# Altium project hexboard.PrjPcb
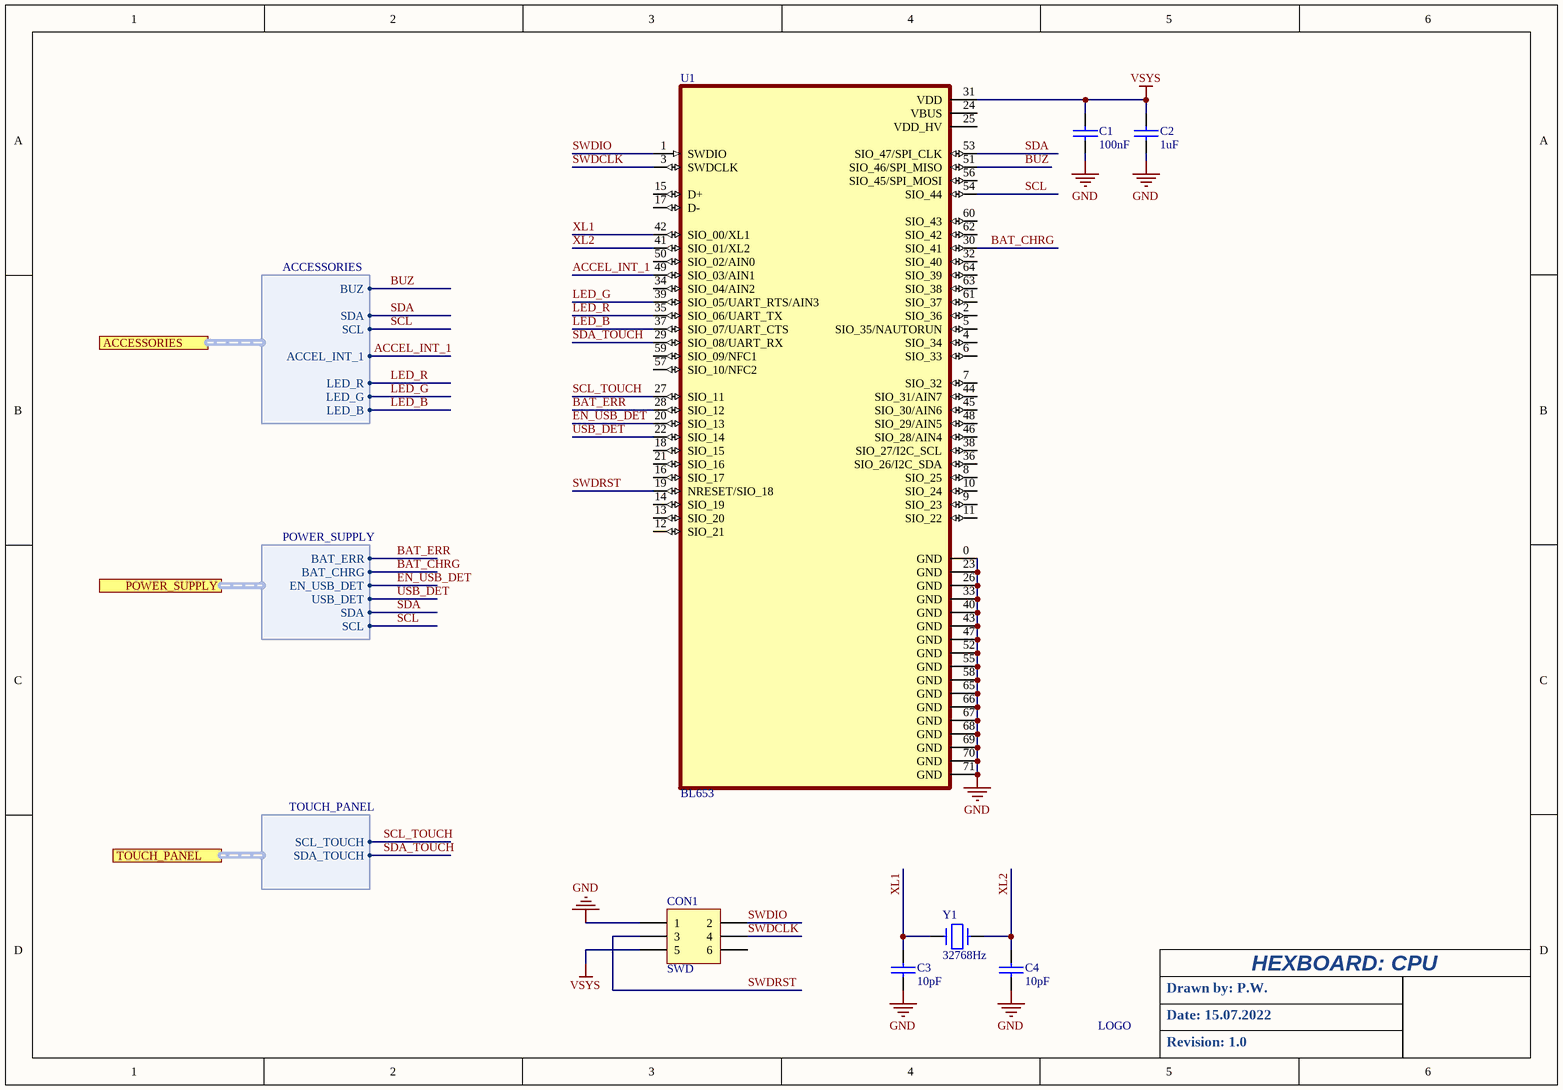
[diagram p0: CPU.SchDoc]
4 sheets, 67 parts. Net scope: flat (ports and power ports of the same name join across sheets).
Board files: hexboard_round.PcbDoc, hexboard_bottom.PcbDoc, hexboard_housing.PcbDoc, hexboard_top.PcbDoc
Sheets:
  CPU.SchDoc
  Power_supply.SchDoc
  Accessories.SchDoc
  Touch_panel.SchDoc

## Sheet CPU.SchDoc
size 292 x 203 mm

### Parts
*1  LOGO  [NEWLOGO2]  (value not drawn)
C1  100nF  [C0603L]
C2  1uF  [C0603L]
C3  10pF  [C0603L]
C4  10pF  [C0603L]
CON1  SWD  [HDR2x3_1mm27]
U1  BL653  [BL653]
Y1  32768Hz  [X_FC-13F]

### Ports
ACCESSORIES (harness ACCESSORIES), POWER_SUPPLY (harness POWER_SUPPLY), TOUCH_PANEL (harness TOUCH_PANEL)

### Harnesses
ACCESSORIES: ACCEL_INT_1, LED_R, LED_G, SDA, SCL, LED_B, BUZ
POWER_SUPPLY: BAT_ERR, BAT_CHRG, EN_USB_DET, SDA, SCL, USB_DET
TOUCH_PANEL: SDA_TOUCH, SCL_TOUCH

### Nets
GND: C1.2 C2.2 C3.2 C4.2 CON1.1 U1.0(GND) U1.23(GND) U1.26(GND) U1.33(GND) U1.40(GND) U1.43(GND) U1.47(GND) U1.52(GND) U1.55(GND) U1.58(GND) U1.65(GND) U1.66(GND) U1.67(GND) U1.68(GND) U1.69(GND) U1.70(GND) U1.71(GND)
VSYS: C1.1 C2.1 CON1.5 U1.31(VDD)
ACCEL_INT_1: U1.49(SIO_03/AIN1) ; port ACCESSORIES.ACCEL_INT_1
BAT_CHRG: U1.30(SIO_41) ; port POWER_SUPPLY.BAT_CHRG
BAT_ERR: U1.28(SIO_12) ; port POWER_SUPPLY.BAT_ERR
BUZ: U1.51(SIO_46/SPI_MISO) ; port ACCESSORIES.BUZ
EN_USB_DET: U1.20(SIO_13) ; port POWER_SUPPLY.EN_USB_DET
LED_B: U1.37(SIO_07/UART_CTS) ; port ACCESSORIES.LED_B
LED_G: U1.39(SIO_05/UART_RTS/AIN3) ; port ACCESSORIES.LED_G
LED_R: U1.35(SIO_06/UART_TX) ; port ACCESSORIES.LED_R
SCL: U1.54(SIO_44) ; port ACCESSORIES.SCL, port POWER_SUPPLY.SCL
SCL_TOUCH: U1.27(SIO_11) ; port TOUCH_PANEL.SCL_TOUCH
SDA: U1.53(SIO_47/SPI_CLK) ; port ACCESSORIES.SDA, port POWER_SUPPLY.SDA
SDA_TOUCH: U1.29(SIO_08/UART_RX) ; port TOUCH_PANEL.SDA_TOUCH
SWDCLK: CON1.4 U1.3(SWDCLK)
SWDIO: CON1.2 U1.1(SWDIO)
SWDRST: CON1.3 U1.19(NRESET/SIO_18)
USB_DET: U1.22(SIO_14) ; port POWER_SUPPLY.USB_DET
XL1: C3.1 U1.42(SIO_00/XL1) Y1.1
XL2: C4.1 U1.41(SIO_01/XL2) Y1.2

Not connected (* = marked no-connect by the designer): CON1 6; U1 2(SIO_36) 4(SIO_34) 5(SIO_35/NAUTORUN) 6(SIO_33) 7(SIO_32) 8(SIO_25) 9(SIO_23) 10(SIO_24) 11(SIO_22) 12(SIO_21) 13(SIO_20) 14(SIO_19) 15(D+) 16(SIO_17) 17(D-) 18(SIO_15) 21(SIO_16) 24(VBUS) 25(VDD_HV) 32(SIO_40) 34(SIO_04/AIN2) 36(SIO_26/I2C_SDA) 38(SIO_27/I2C_SCL) 44(SIO_31/AIN7) 45(SIO_30/AIN6) 46(SIO_28/AIN4) 48(SIO_29/AIN5) 50(SIO_02/AIN0) 56(SIO_45/SPI_MOSI) 57(SIO_10/NFC2) 59(SIO_09/NFC1) 60(SIO_43) 61(SIO_37) 62(SIO_42) 63(SIO_38) 64(SIO_39)

### Notes on the sheet
- HEXBOARD: CPU
- Drawn by: P.W.
- Date: 15.07.2022
- Revision: 1.0

### Library data of the parts
C1-C4 = CAP: Capacitor
CON1 = Header 3X2: Header, 3-Pin, Dual row; LatestRevisionDate: 17-Jul-2002; LatestRevisionNote: Re-released for DXP Platform.; Publisher: Altium Limited
U1 = BL653: 802.15.4, Bluetooth Bluetooth v5.0, Thread Transceiver Module 2.4GHz Integrated, Trace Surface Mount; MP: 451-00001; MF: Laird -; Digi-Key_Part_Number: 451-00001CT-ND; Value: *; SnapEDA_Link: https://www.snapeda.com/parts/451-00001/Laird%20-%20Wireless%20%26%20Thermal%20Systems/view-part/2777643/?ref=snap; Package: Module Laird -; Digi-Key_Purchase_URL: https://www.digikey.com/product-detail/en/laird-wireless-thermal-systems/451-00001/451-00001CT-ND/9489361?utm_source=snapeda&utm_medium=aggregator&utm_campaign=symbol
Y1 = CRYSTAL

## Sheet Power_supply.SchDoc
size 368 x 223 mm
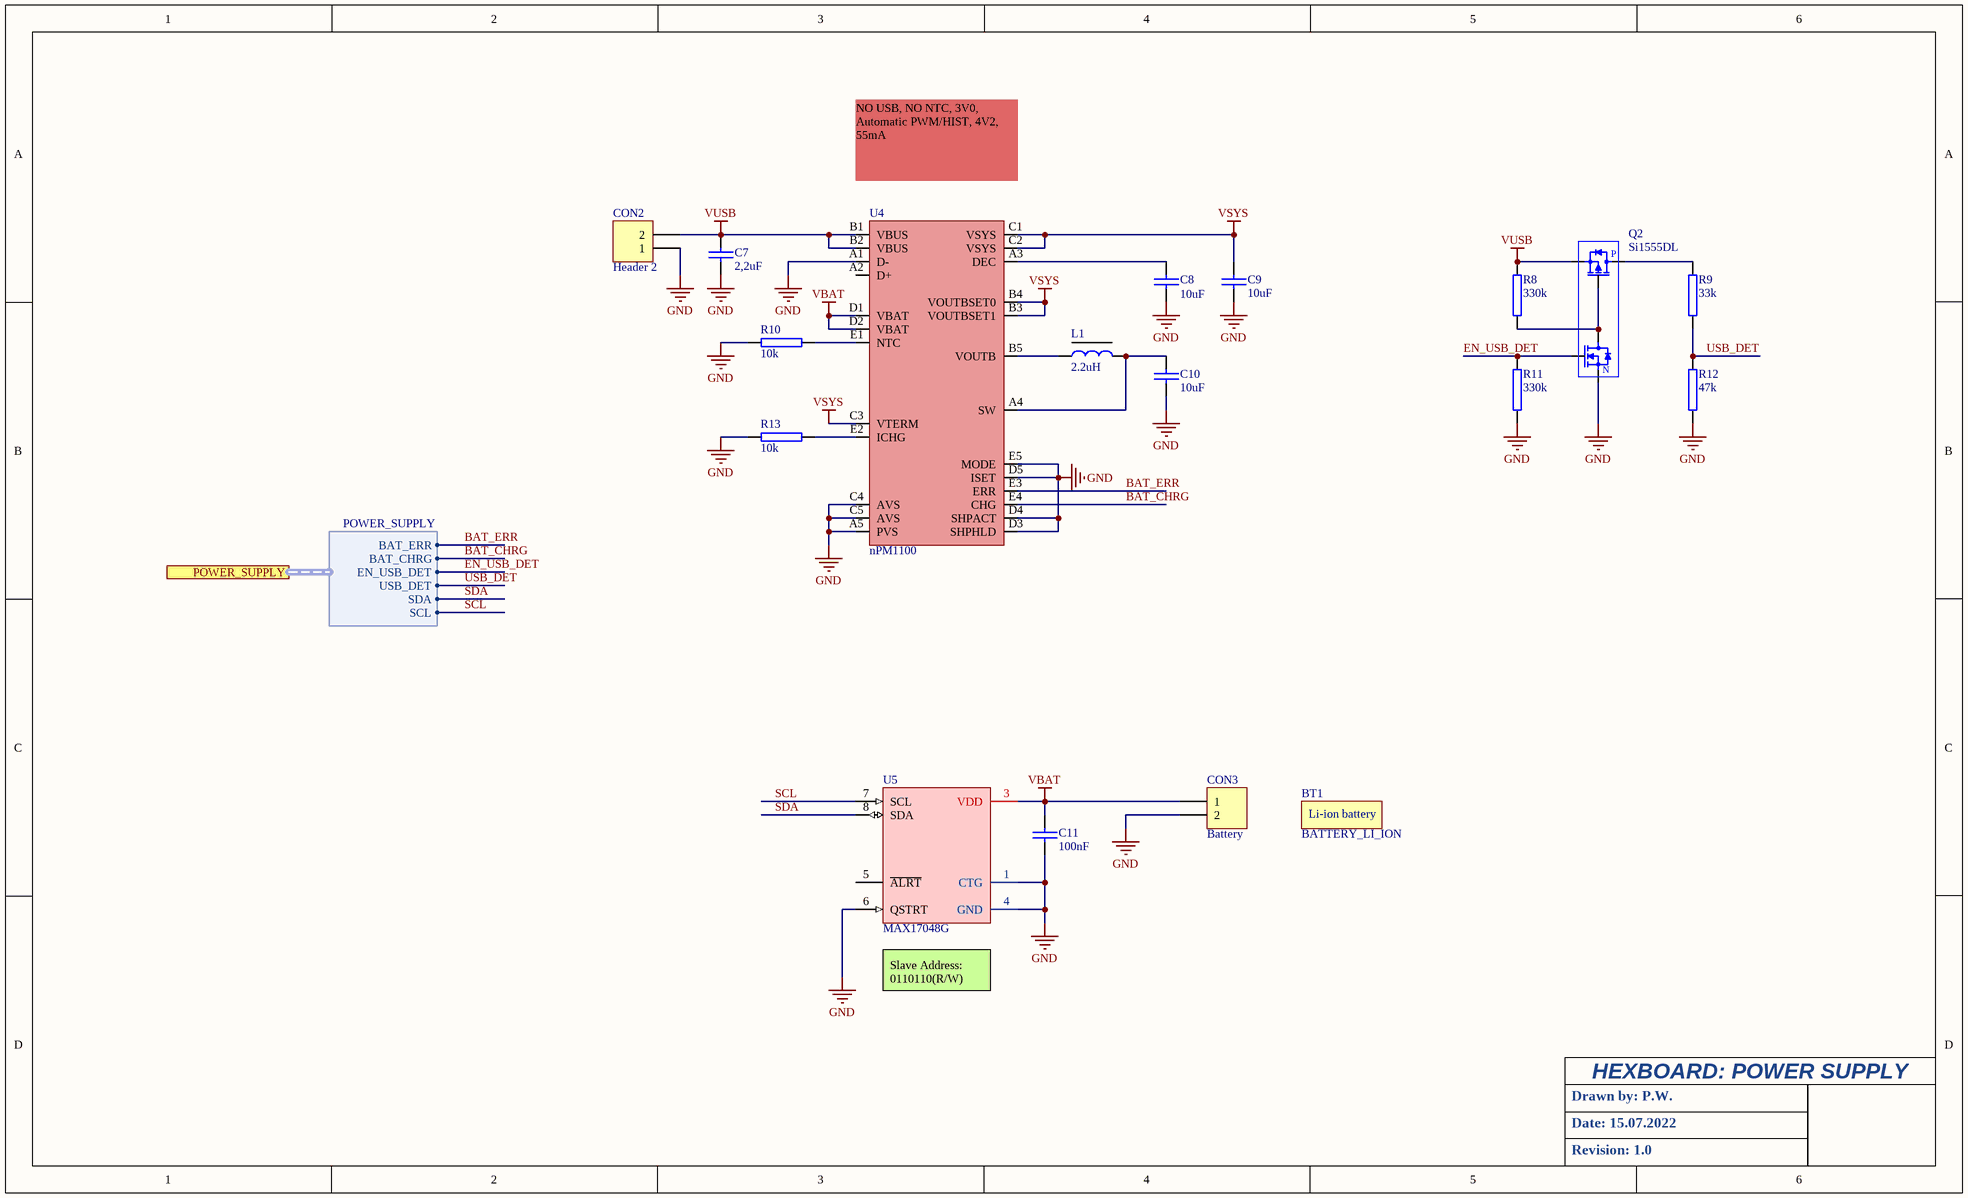
[diagram p1: Power_supply.SchDoc]

### Parts
BT1  BATTERY_LI_ION  [LI-ion battery 100mAh]
C7  2,2uF  [C0603L]
C8  10uF  [C0603L]
C9  10uF  [C0603L]
C10  10uF  [C0603L]
C11  100nF  [C0603L]
CON2  Header 2  [HDR1X2]
CON3  Battery  [HDR1X2_1mm27]
L1  2.2uH  [L0805]
Q2  Si1555DL  [SOT-363]
R8  330k  [1608[0603]]
R9  33k  [1608[0603]]
R10  10k  [1608[0603]]
R11  330k  [1608[0603]]
R12  47k  [1608[0603]]
R13  10k  [1608[0603]]
U4  nPM1100  [BGA25C40P5X5_207X207X52N]
U5  MAX17048G  [TDFN8_2x2x075]

### Ports
POWER_SUPPLY (harness POWER_SUPPLY)

### Harnesses
POWER_SUPPLY: BAT_ERR, BAT_CHRG, EN_USB_DET, SDA, SCL, USB_DET

### Nets
GND: C7.2 C8.2 C9.2 C10.2 C11.2 CON2.1 CON3.2 Q2.1(S1) R10.2 R11.1 R12.1 R13.2 U4.A1(D-) U4.A5(PVS) U4.C4(AVS) U4.C5(AVS) U4.D3(SHPHLD) U4.D4(SHPACT) U4.D5(ISET) U4.E5(MODE) U5.1(CTG) U5.4(GND) U5.6(QSTRT)
VBAT: C11.1 CON3.1 U4.D1(VBAT) U4.D2(VBAT) U5.3(VDD)
VSYS: C9.1 U4.B3(VOUTBSET1) U4.B4(VOUTBSET0) U4.C1(VSYS) U4.C2(VSYS) U4.C3(VTERM)
VUSB: C7.1 CON2.2 Q2.4(S2) R8.2 U4.B1(VBUS) U4.B2(VBUS)
BAT_CHRG: U4.E4(CHG) ; port POWER_SUPPLY.BAT_CHRG
BAT_ERR: U4.E3(ERR) ; port POWER_SUPPLY.BAT_ERR
EN_USB_DET: Q2.2(G1) R11.2 ; port POWER_SUPPLY.EN_USB_DET
SCL: U5.7(SCL) ; port POWER_SUPPLY.SCL
SDA: U5.8(SDA) ; port POWER_SUPPLY.SDA
USB_DET: R9.1 R12.2 ; port POWER_SUPPLY.USB_DET
NetC8_1: C8.1 U4.A3(DEC)
NetC10_1: C10.1 L1.2 U4.A4(SW)
NetL1_1: L1.1 U4.B5(VOUTB)
NetQ2_3: Q2.3(D2) R9.2
NetQ2_5: Q2.5(G2) Q2.6(D1) R8.1
NetR10_1: R10.1 U4.E1(NTC)
NetR13_1: R13.1 U4.E2(ICHG)

Not connected (* = marked no-connect by the designer): U4 A2(D+); U5 5(~{ALRT})

### Notes on the sheet
- NO USB, NO NTC, 3V0, Automatic PWM/HIST, 4V2, 55mA
- (near U5) Slave Address:
  0110110(R/W)
- HEXBOARD: POWER SUPPLY
- Drawn by: P.W.
- Date: 15.07.2022
- Revision: 1.0
- (in symbol BATTERY_LI_ION) Li-ion battery
- (in symbol Si1555DL) P; N

### Library data of the parts
BT1 = BATTERY_LI_ION: Battery
C7-C11 = CAP: Capacitor
CON2 CON3 = Header 2: Header, 2-Pin; LatestRevisionDate: 17-Jul-2002; LatestRevisionNote: Re-released for DXP Platform.; Publisher: Altium Limited
L1 = INDUCTOR
Q2 = Si1555DL: Montage: SMD; ComponentLink1Description: Datasheet; ComponentLink1URL: https://www.diodes.com/assets/Datasheets/ds30380.pdf
R8-R13 = RES
U4 = nPM1100: Integrated Power Managment IC
U5 = MAX17048G: 1-Cell/2-Cell Fuel Gauge with ModelGauge

## Sheet Accessories.SchDoc
size A4
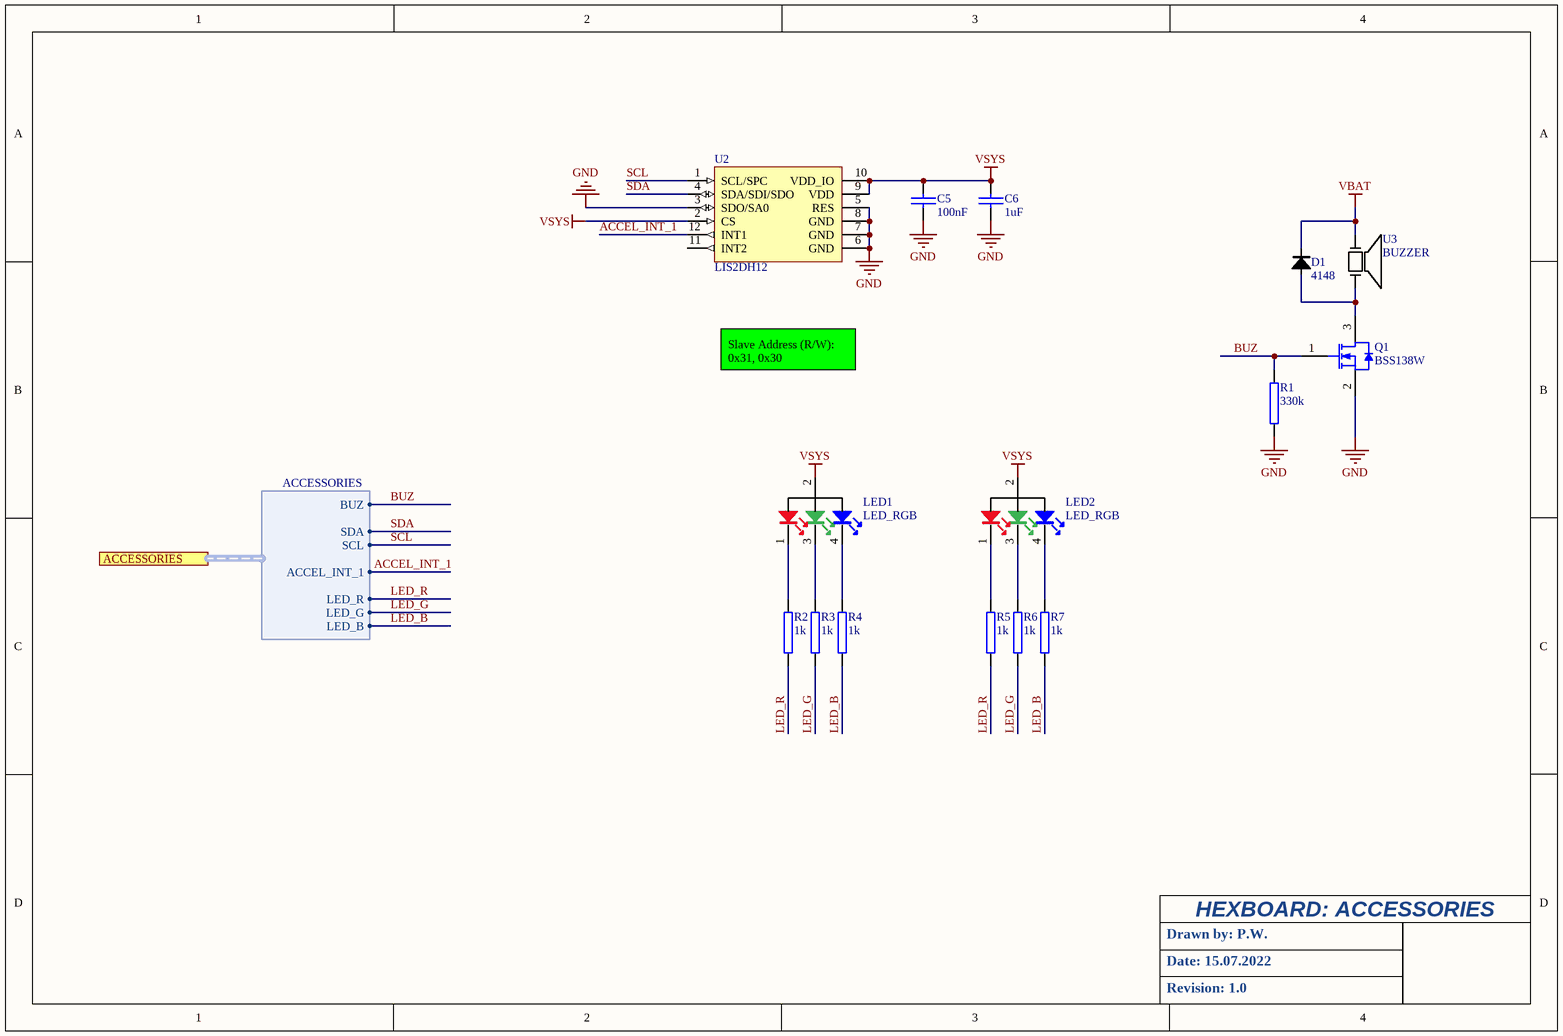
[diagram p2: Accessories.SchDoc]

### Parts
C5  100nF  [C0603L]
C6  1uF  [C0603L]
D1  4148  [0603-DIODE]
LED1  LED_RGB  [LED_604APFA3010LSEEZGKQ]
LED2  LED_RGB  [LED_604APFA3010LSEEZGKQ]
Q1  BSS138W  [SOT-323]
R1  330k  [1608[0603]]
R2  1k  [1608[0603]]
R3  1k  [1608[0603]]
R4  1k  [1608[0603]]
R5  1k  [1608[0603]]
R6  1k  [1608[0603]]
R7  1k  [1608[0603]]
U2  LIS2DH12  [LGA50P200X200X100-12N]
U3  BUZZER  [SMT28]

### Ports
ACCESSORIES (harness ACCESSORIES)

### Harnesses
ACCESSORIES: ACCEL_INT_1, LED_R, LED_G, SDA, SCL, LED_B, BUZ

### Nets
GND: C5.2 C6.2 Q1.2(S) R1.1 U2.3(SDO/SA0) U2.5(RES) U2.6(GND) U2.7(GND) U2.8(GND)
VBAT: D1.2(K) U3.2
VSYS: C5.1 C6.1 LED1.2(KG) LED2.2(KG) U2.2(CS) U2.9(VDD) U2.10(VDD_IO)
ACCEL_INT_1: U2.12(INT1) ; port ACCESSORIES.ACCEL_INT_1
BUZ: Q1.1(G) R1.2 ; port ACCESSORIES.BUZ
LED_B: R4.1 R7.1 ; port ACCESSORIES.LED_B
LED_G: R3.1 R6.1 ; port ACCESSORIES.LED_G
LED_R: R2.1 R5.1 ; port ACCESSORIES.LED_R
SCL: U2.1(SCL/SPC) ; port ACCESSORIES.SCL
SDA: U2.4(SDA/SDI/SDO) ; port ACCESSORIES.SDA
NetD1_1: D1.1(A) Q1.3(D) U3.1
NetLED1_1: LED1.1(KR) R2.2
NetLED1_3: LED1.3(KB) R3.2
NetLED1_4: LED1.4(AB) R4.2
NetLED2_1: LED2.1(KR) R5.2
NetLED2_3: LED2.3(KB) R6.2
NetLED2_4: LED2.4(AB) R7.2

Not connected (* = marked no-connect by the designer): U2 11(INT2)

### Notes on the sheet
- Slave Address (R/W): 0x31, 0x30
- HEXBOARD: ACCESSORIES
- Drawn by: P.W.
- Date: 15.07.2022
- Revision: 1.0

### Library data of the parts
C5 C6 = CAP: Capacitor
D1 = D: DIODE
LED1 LED2 = LED_RGB_2: Red/green/blue LED
Q1 = BSS138W: N-MOSFET; Manufacturer 1: -; Manufacturer 1 PartNo: -; Supplier 1: -; Supplier 1 PartNo: -
R1-R7 = RES
U2 = LIS2xx12: 3-axis - ±2g/±4g/±8g/±16g digital output femto accelerometer; Manufacturer: STMicroelectronics; 2nd source part number: 243-3081; Part number IPS: 00000007817; Note: MEMS digital output motion sensor ultra low-power high performance 3-axes "femto" accelerometer; Artikkelnr Noca: N.A.; Part Number: LIS2DH12; Manufacturer Part Number: LIS2DH12; Datasheet: http://www.st.com/st-web-ui/static/active/en/resource/technical/document/datasheet/DM00091513.pdf; Footprint Doc: LGA-12; LatestRevisionDate: 2015-09-29; Pin Count: 12; Publisher: Nordic Semiconductor; Published: 2015-09-29; Value: LIS2DH12; Supplier: Digi-Key; Supplier part number: 497-14851-1-ND; 2nd source Supplier: Farnell; Artikkelnr Simpro: N.A.

## Sheet Touch_panel.SchDoc
size 381 x 279 mm
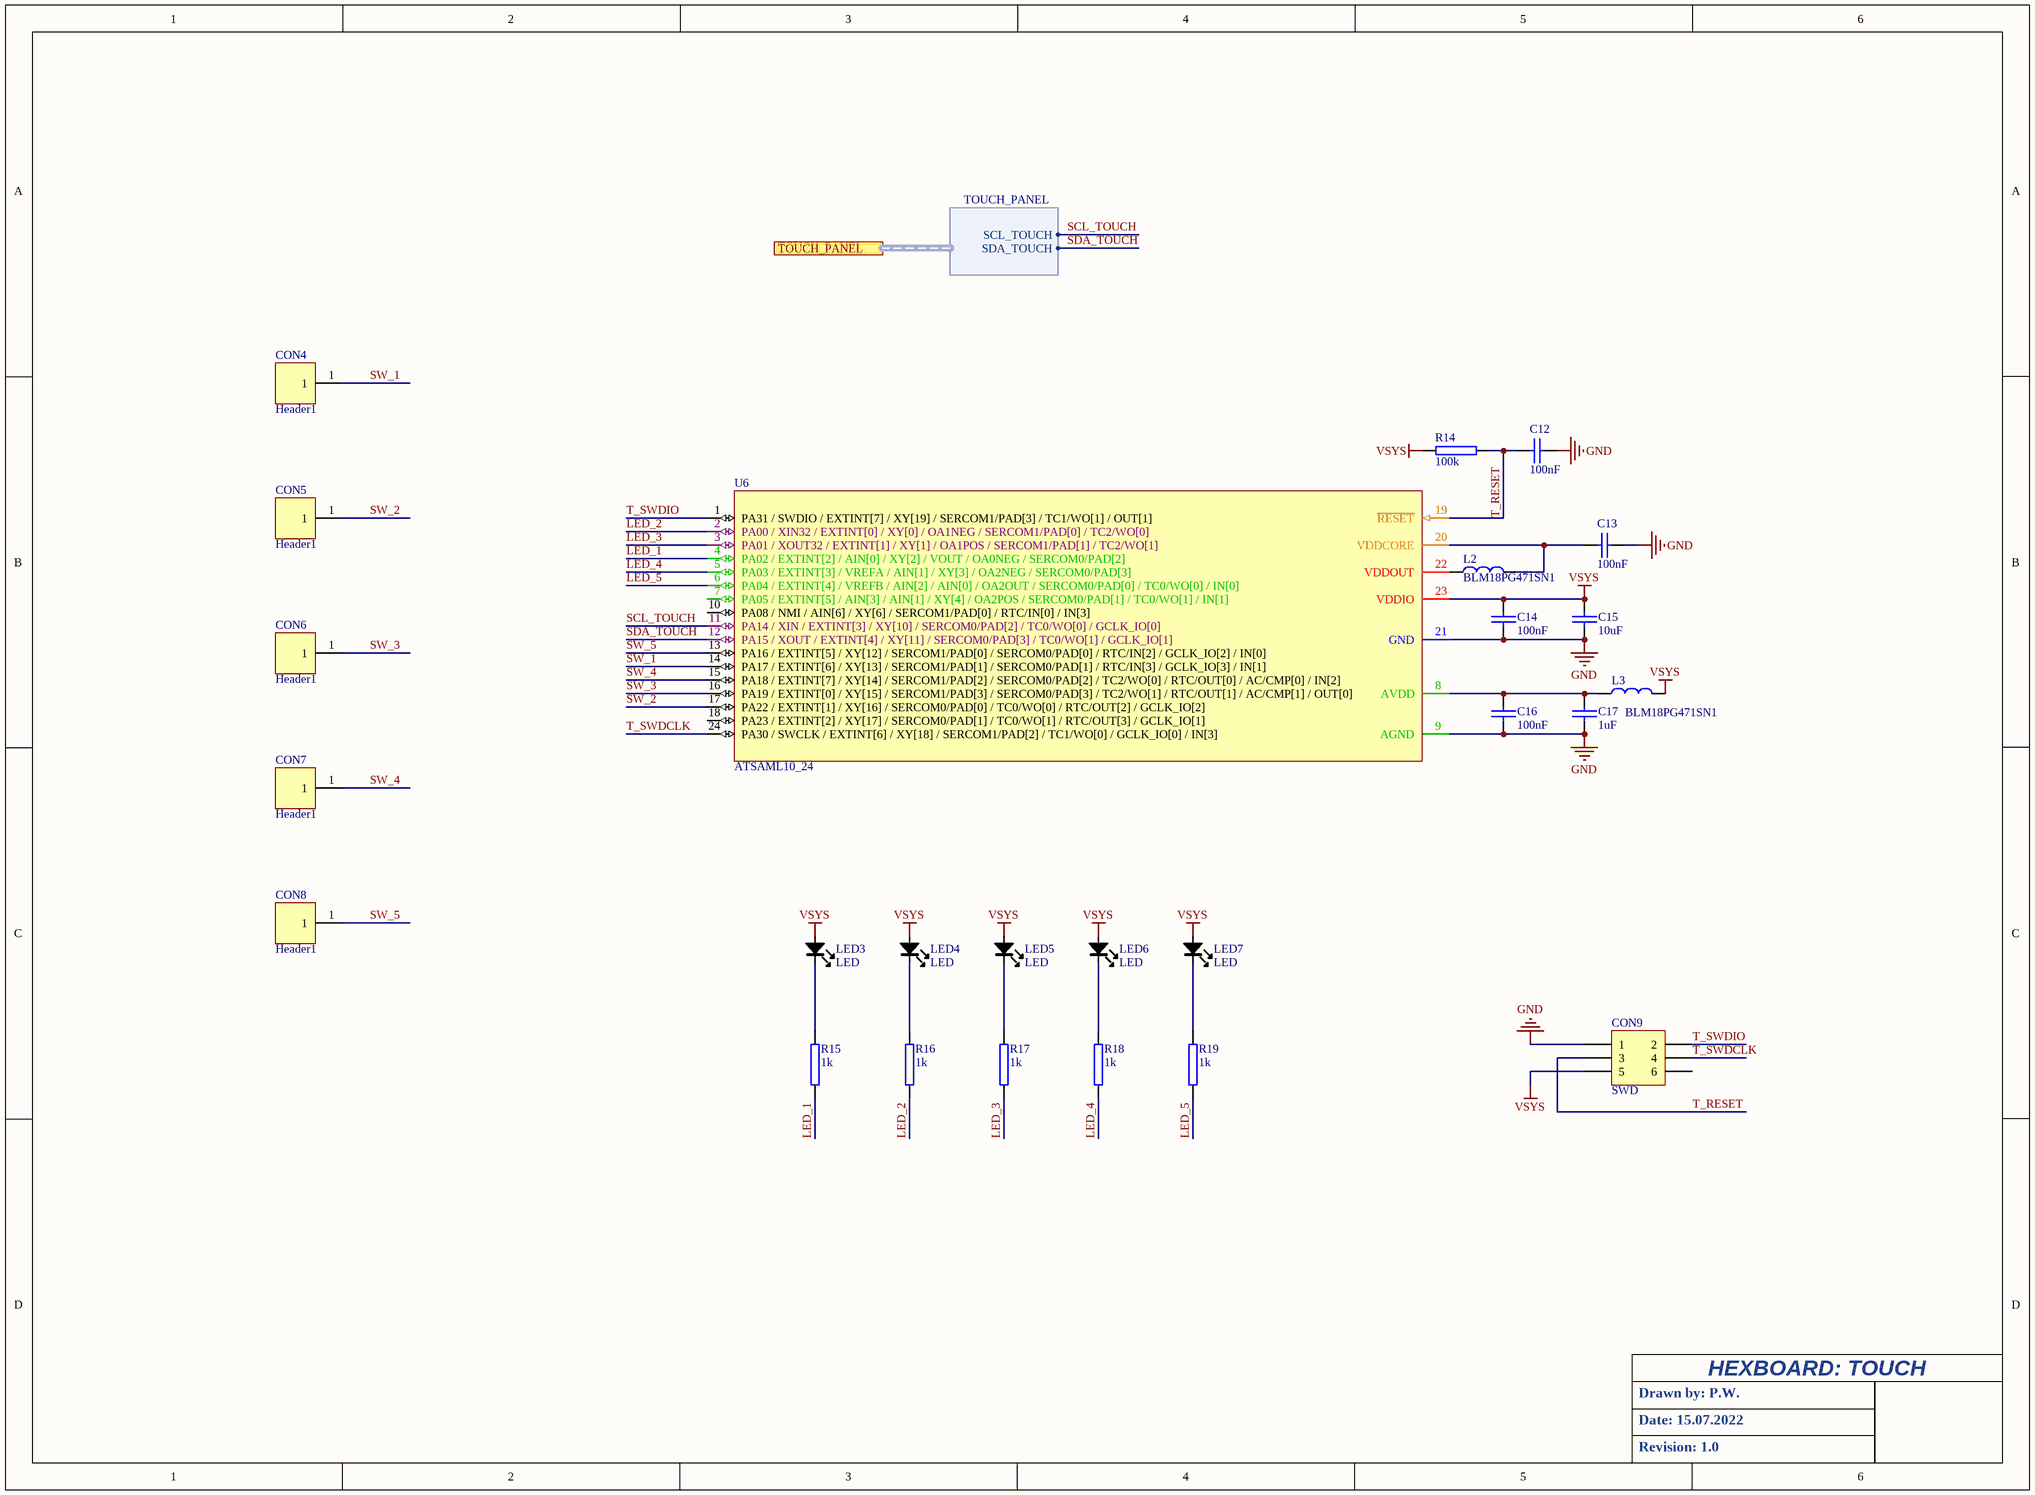
[diagram p3: Touch_panel.SchDoc]

### Parts
C12  100nF  [C0603L]
C13  100nF  [C0603L]
C14  100nF  [C0603L]
C15  10uF  [C0603L]
C16  100nF  [C0603L]
C17  1uF  [C0603L]
CON4  Header1  [P_CAP_13mm_B]
CON5  Header1  [P_CAP_13mm_B]
CON6  Header1  [P_CAP_13mm_B]
CON7  Header1  [P_CAP_13mm_B]
CON8  Header1  [P_CAP_13mm_B]
CON9  SWD  [HDR2x3_1mm27]
L2  BLM18PG471SN1  [L0805]
L3  BLM18PG471SN1  [L0805]
LED3  LED  [LED1206_BOTTOM_2_5]
LED4  LED  [LED1206_BOTTOM_2_5]
LED5  LED  [LED1206_BOTTOM_2_5]
LED6  LED  [LED1206_BOTTOM_2_5]
LED7  LED  [LED1206_BOTTOM_2_5]
R14  100k  [1608[0603]]
R15  1k  [1608[0603]]
R16  1k  [1608[0603]]
R17  1k  [1608[0603]]
R18  1k  [1608[0603]]
R19  1k  [1608[0603]]
U6  ATSAML10_24  [QFN24_4x4]

### Ports
TOUCH_PANEL (harness TOUCH_PANEL)

### Harnesses
TOUCH_PANEL: SDA_TOUCH, SCL_TOUCH

### Nets
GND: C12.2 C13.2 C14.2 C15.2 C16.2 C17.2 CON9.1 U6.9(AGND) U6.21(GND)
VSYS: C14.1 C15.1 CON9.5 L3.2 LED3.1(A) LED4.1(A) LED5.1(A) LED6.1(A) LED7.1(A) R14.1 U6.23(VDDIO)
LED_1: R15.1 U6.4(PA02_/_EXTINT[2]_/_AIN[0]_/_XY[2]_/_VOUT_/_OA0NEG_/_SERCOM0/PAD[2])
LED_2: R16.2 U6.2(PA00_/_XIN32_/_EXTINT[0]_/_XY[0]_/_OA1NEG_/_SERCOM1/PAD[0]_/_TC2/WO[0])
LED_3: R17.1 U6.3(PA01_/_XOUT32_/_EXTINT[1]_/_XY[1]_/_OA1POS_/_SERCOM1/PAD[1]_/_TC2/WO[1])
LED_4: R18.1 U6.5(PA03_/_EXTINT[3]_/_VREFA_/_AIN[1]_/_XY[3]_/_OA2NEG_/_SERCOM0/PAD[3])
LED_5: R19.2 U6.6(PA04_/_EXTINT[4]_/_VREFB_/_AIN[2]_/_AIN[0]_/_OA2OUT_/_SERCOM0/PAD[0]_/_TC0/WO[0]_/_IN[0])
SCL_TOUCH: U6.11(PA14_/_XIN_/_EXTINT[3]_/_XY[10]_/_SERCOM0/PAD[2]_/_TC0/WO[0]_/_GCLK_IO[0]) ; port TOUCH_PANEL.SCL_TOUCH
SDA_TOUCH: U6.12(PA15_/_XOUT_/_EXTINT[4]_/_XY[11]_/_SERCOM0/PAD[3]_/_TC0/WO[1]_/_GCLK_IO[1]) ; port TOUCH_PANEL.SDA_TOUCH
SW_1: CON4.1 U6.14(PA17_/_EXTINT[6]_/_XY[13]_/_SERCOM1/PAD[1]_/_SERCOM0/PAD[1]_/_RTC/IN[3]_/_GCLK_IO[3]_/_IN[1])
SW_2: CON5.1 U6.17(PA22_/_EXTINT[1]_/_XY[16]_/_SERCOM0/PAD[0]_/_TC0/WO[0]_/_RTC/OUT[2]_/_GCLK_IO[2])
SW_3: CON6.1 U6.16(PA19_/_EXTINT[0]_/_XY[15]_/_SERCOM1/PAD[3]_/_SERCOM0/PAD[3]_/_TC2/WO[1]_/_RTC/OUT[1]_/_AC/CMP[1]_/_OUT[0])
SW_4: CON7.1 U6.15(PA18_/_EXTINT[7]_/_XY[14]_/_SERCOM1/PAD[2]_/_SERCOM0/PAD[2]_/_TC2/WO[0]_/_RTC/OUT[0]_/_AC/CMP[0]_/_IN[2])
SW_5: CON8.1 U6.13(PA16_/_EXTINT[5]_/_XY[12]_/_SERCOM1/PAD[0]_/_SERCOM0/PAD[0]_/_RTC/IN[2]_/_GCLK_IO[2]_/_IN[0])
T_RESET: C12.1 CON9.3 R14.2 U6.19(~{RESET})
T_SWDCLK: CON9.4 U6.24(PA30_/_SWCLK_/_EXTINT[6]_/_XY[18]_/_SERCOM1/PAD[2]_/_TC1/WO[0]_/_GCLK_IO[0]_/_IN[3])
T_SWDIO: CON9.2 U6.1(PA31_/_SWDIO_/_EXTINT[7]_/_XY[19]_/_SERCOM1/PAD[3]_/_TC1/WO[1]_/_OUT[1])
NetC13_1: C13.1 L2.2 U6.20(VDDCORE)
NetC16_1: C16.1 C17.1 L3.1 U6.8(AVDD)
NetL2_1: L2.1 U6.22(VDDOUT)
NetLED3_2: LED3.2(K) R15.2
NetLED4_2: LED4.2(K) R16.1
NetLED5_2: LED5.2(K) R17.2
NetLED6_2: LED6.2(K) R18.2
NetLED7_2: LED7.2(K) R19.1

Not connected (* = marked no-connect by the designer): CON9 6; U6 7(PA05_/_EXTINT[5]_/_AIN[3]_/_AIN[1]_/_XY[4]_/_OA2POS_/_SERCOM0/PAD[1]_/_TC0/WO[1]_/_IN[1]) 10(PA08_/_NMI_/_AIN[6]_/_XY[6]_/_SERCOM1/PAD[0]_/_RTC/IN[0]_/_IN[3]) 18(PA23_/_EXTINT[2]_/_XY[17]_/_SERCOM0/PAD[1]_/_TC0/WO[1]_/_RTC/OUT[3]_/_GCLK_IO[1])

### Notes on the sheet
- HEXBOARD: TOUCH
- Drawn by: P.W.
- Date: 15.07.2022
- Revision: 1.0

### Library data of the parts
C12-C17 = CAP: Capacitor
CON9 = Header 3X2: Header, 3-Pin, Dual row; LatestRevisionDate: 17-Jul-2002; LatestRevisionNote: Re-released for DXP Platform.; Publisher: Altium Limited
L2 L3 = INDUCTOR
R14-R19 = RES
U6 = ATSAML10D15: Cortex M0+ microcontroller

## Nets that join several sheets
GND: CPU (22 pins), Power_supply (23 pins), Accessories (9 pins), Touch_panel (9 pins)
VBAT: Power_supply (5 pins), Accessories (D1.2 U3.2)
VSYS: CPU (C1.1 C2.1 CON1.5 U1.31), Power_supply (6 pins), Accessories (7 pins), Touch_panel (11 pins)
ACCEL_INT_1: CPU (U1.49), Accessories (U2.12)
BAT_CHRG: CPU (U1.30), Power_supply (U4.E4)
BAT_ERR: CPU (U1.28), Power_supply (U4.E3)
BUZ: CPU (U1.51), Accessories (Q1.1 R1.2)
EN_USB_DET: CPU (U1.20), Power_supply (Q2.2 R11.2)
LED_B: CPU (U1.37), Accessories (R4.1 R7.1)
LED_G: CPU (U1.39), Accessories (R3.1 R6.1)
LED_R: CPU (U1.35), Accessories (R2.1 R5.1)
SCL: CPU (U1.54), Power_supply (U5.7), Accessories (U2.1)
SCL_TOUCH: CPU (U1.27), Touch_panel (U6.11)
SDA: CPU (U1.53), Power_supply (U5.8), Accessories (U2.4)
SDA_TOUCH: CPU (U1.29), Touch_panel (U6.12)
USB_DET: CPU (U1.22), Power_supply (R9.1 R12.2)